# Altium project KR-Df-01-EL-00.PrjPcb (part 1 of 2)
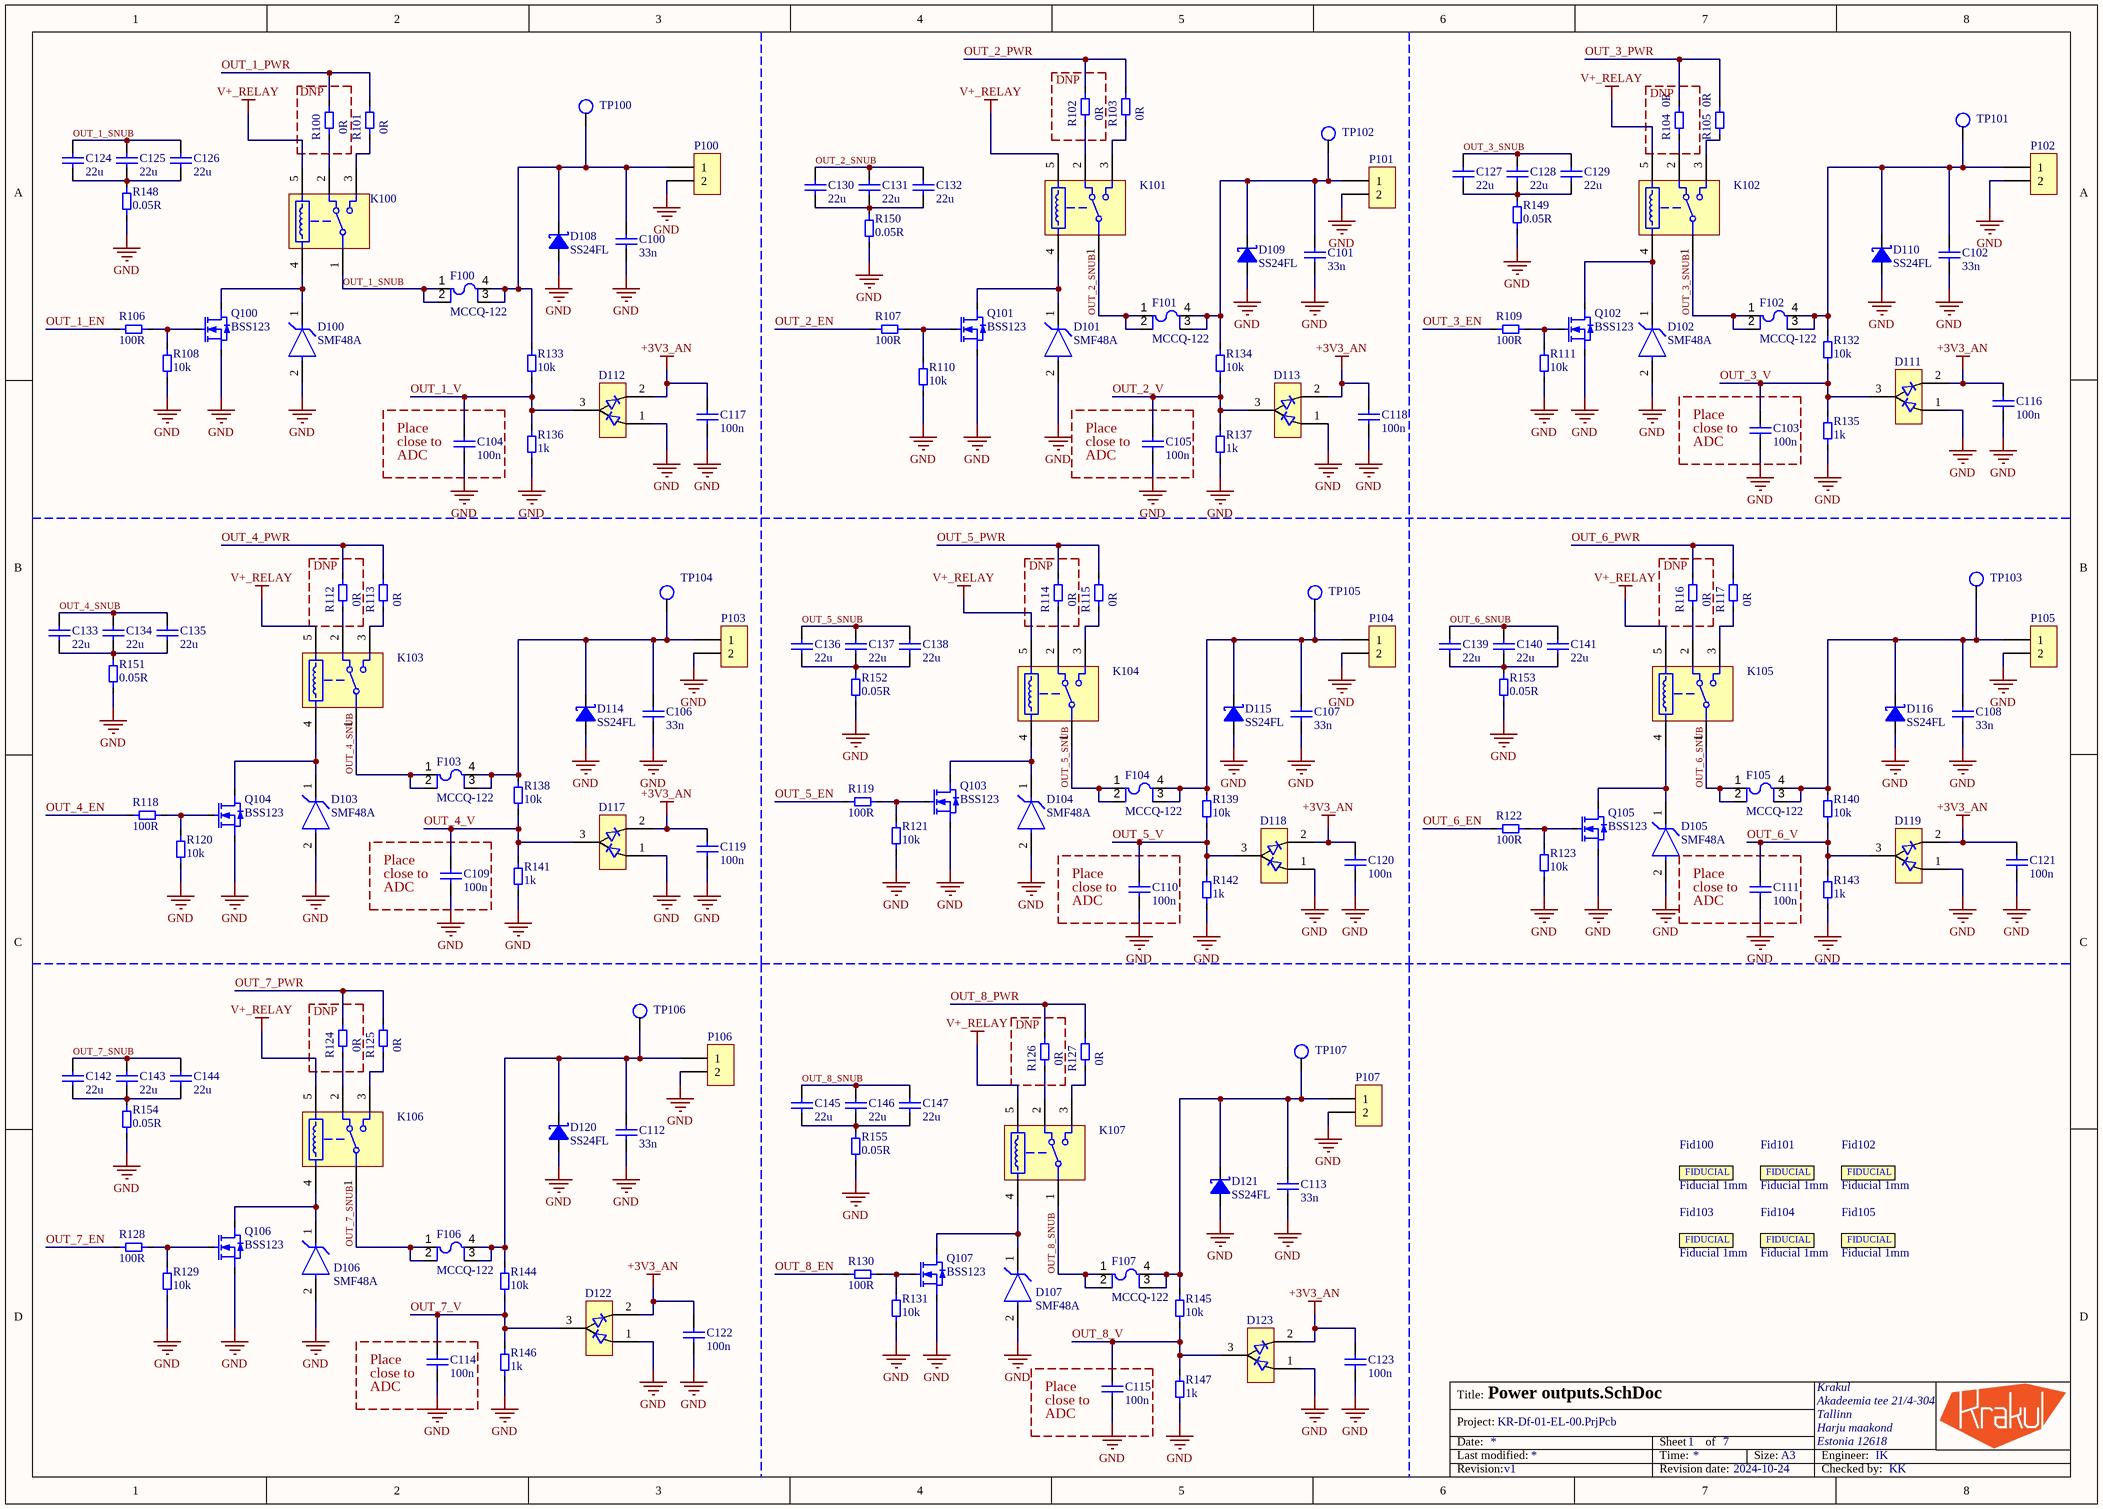
[diagram p0: Power outputs.SchDoc]
GlobalAddress1: Akadeemia tee 21/4-304; GlobalAddress2: Tallinn; GlobalAddress3: Harju maakond; GlobalAddress4: Estonia 12618; GlobalChecked: KK; GlobalCheckedBy: KK; GlobalCheckedByDate: 2024-02-23; GlobalCompanyName: Krakul; GlobalEngineer: IK; GlobalProjectRevision: v1; GlobalProjectTitle: KR-Df-01-EL-00; GlobalProjectTitleAbr: Fuse Board; GlobalRevisionDate: 2024-10-24; GlobalRevisionEngineer: IK,KK
7 sheets, 456 parts. Net scope: global (net labels, ports and power ports of the same name join across sheets).
Board file: KR-Df-01-EL-00.PcbDoc
Sheets:
  Power outputs.SchDoc
  Ethernet.SchDoc
  RS485.SchDoc
  Power input.SchDoc
  MCU.SchDoc
  LEDs_Switches.SchDoc
  Revision history.SchDoc

## Sheet Power outputs.SchDoc: Name project title here
size A3; Organization: Krakul OÜ; Address1: Kaare tee 3, lubja; Address2: viimsi vald; Address3: harju maakond; Address4: Estonia 74010; DocumentNumber: No here; Revision: 0; SheetNumber: 1; SheetTotal: 7

### Parts
C100  33n  [MLCC_0805_M]
C101  33n  [MLCC_0805_M]
C102  33n  [MLCC_0805_M]
C103  100n  [MLCC_0402_M]
C104  100n  [MLCC_0402_M]
C105  100n  [MLCC_0402_M]
C106  33n  [MLCC_0805_M]
C107  33n  [MLCC_0805_M]
C108  33n  [MLCC_0805_M]
C109  100n  [MLCC_0402_M]
C110  100n  [MLCC_0402_M]
C111  100n  [MLCC_0402_M]
C112  33n  [MLCC_0805_M]
C113  33n  [MLCC_0805_M]
C114  100n  [MLCC_0402_M]
C115  100n  [MLCC_0402_M]
C116  100n  [MLCC_0402_M]
C117  100n  [MLCC_0402_M]
C118  100n  [MLCC_0402_M]
C119  100n  [MLCC_0402_M]
C120  100n  [MLCC_0402_M]
C121  100n  [MLCC_0402_M]
C122  100n  [MLCC_0402_M]
C123  100n  [MLCC_0402_M]
C124  22u  [MLCC_0805_M]
C125  22u  [MLCC_0805_M]
C126  22u  [MLCC_0805_M]
C127  22u  [MLCC_0805_M]
C128  22u  [MLCC_0805_M]
C129  22u  [MLCC_0805_M]
C130  22u  [MLCC_0805_M]
C131  22u  [MLCC_0805_M]
C132  22u  [MLCC_0805_M]
C133  22u  [MLCC_0805_M]
C134  22u  [MLCC_0805_M]
C135  22u  [MLCC_0805_M]
C136  22u  [MLCC_0805_M]
C137  22u  [MLCC_0805_M]
C138  22u  [MLCC_0805_M]
C139  22u  [MLCC_0805_M]
C140  22u  [MLCC_0805_M]
C141  22u  [MLCC_0805_M]
C142  22u  [MLCC_0805_M]
C143  22u  [MLCC_0805_M]
C144  22u  [MLCC_0805_M]
C145  22u  [MLCC_0805_M]
C146  22u  [MLCC_0805_M]
C147  22u  [MLCC_0805_M]
D100  SMF48A  [FP-SMF48A-MFG]
D101  SMF48A  [FP-SMF48A-MFG]
D102  SMF48A  [FP-SMF48A-MFG]
D103  SMF48A  [FP-SMF48A-MFG]
D104  SMF48A  [FP-SMF48A-MFG]
D105  SMF48A  [FP-SMF48A-MFG]
D106  SMF48A  [FP-SMF48A-MFG]
D107  SMF48A  [FP-SMF48A-MFG]
D108  SS24FL  [SOD-123F]
D109  SS24FL  [SOD-123F]
D110  SS24FL  [SOD-123F]
D111  BAT6404WH6327XTSA1  [SOT323, SC70]  (value not drawn)
D112  BAT6404WH6327XTSA1  [SOT323, SC70]  (value not drawn)
D113  BAT6404WH6327XTSA1  [SOT323, SC70]  (value not drawn)
D114  SS24FL  [SOD-123F]
D115  SS24FL  [SOD-123F]
D116  SS24FL  [SOD-123F]
D117  BAT6404WH6327XTSA1  [SOT323, SC70]  (value not drawn)
D118  BAT6404WH6327XTSA1  [SOT323, SC70]  (value not drawn)
D119  BAT6404WH6327XTSA1  [SOT323, SC70]  (value not drawn)
D120  SS24FL  [SOD-123F]
D121  SS24FL  [SOD-123F]
D122  BAT6404WH6327XTSA1  [SOT323, SC70]  (value not drawn)
D123  BAT6404WH6327XTSA1  [SOT323, SC70]  (value not drawn)
F100  MCCQ-122  [MCCQ-122-Footprint-1]
F101  MCCQ-122  [MCCQ-122-Footprint-1]
F102  MCCQ-122  [MCCQ-122-Footprint-1]
F103  MCCQ-122  [MCCQ-122-Footprint-1]
F104  MCCQ-122  [MCCQ-122-Footprint-1]
F105  MCCQ-122  [MCCQ-122-Footprint-1]
F106  MCCQ-122  [MCCQ-122-Footprint-1]
F107  MCCQ-122  [MCCQ-122-Footprint-1]
Fid100  Fiducial 1mm  [FIDUCIAL 1mm]
Fid101  Fiducial 1mm  [FIDUCIAL 1mm]
Fid102  Fiducial 1mm  [FIDUCIAL 1mm]
Fid103  Fiducial 1mm  [FIDUCIAL 1mm]
Fid104  Fiducial 1mm  [FIDUCIAL 1mm]
Fid105  Fiducial 1mm  [FIDUCIAL 1mm]
K100  J107F1CS205VDC.45  [J107F1CS205VDC.45]  (value not drawn)
K101  J107F1CS205VDC.45  [J107F1CS205VDC.45]  (value not drawn)
K102  J107F1CS205VDC.45  [J107F1CS205VDC.45]  (value not drawn)
K103  J107F1CS205VDC.45  [J107F1CS205VDC.45]  (value not drawn)
K104  J107F1CS205VDC.45  [J107F1CS205VDC.45]  (value not drawn)
K105  J107F1CS205VDC.45  [J107F1CS205VDC.45]  (value not drawn)
K106  J107F1CS205VDC.45  [J107F1CS205VDC.45]  (value not drawn)
K107  J107F1CS205VDC.45  [J107F1CS205VDC.45]  (value not drawn)
P100  DGPS2.5R-5.0-02P  [DGPS2.5R-5.0-02P-Footprint-1]  (value not drawn)
P101  DGPS2.5R-5.0-02P  [DGPS2.5R-5.0-02P-Footprint-1]  (value not drawn)
P102  DGPS2.5R-5.0-02P  [DGPS2.5R-5.0-02P-Footprint-1]  (value not drawn)
P103  DGPS2.5R-5.0-02P  [DGPS2.5R-5.0-02P-Footprint-1]  (value not drawn)
P104  DGPS2.5R-5.0-02P  [DGPS2.5R-5.0-02P-Footprint-1]  (value not drawn)
P105  DGPS2.5R-5.0-02P  [DGPS2.5R-5.0-02P-Footprint-1]  (value not drawn)
P106  DGPS2.5R-5.0-02P  [DGPS2.5R-5.0-02P-Footprint-1]  (value not drawn)
P107  DGPS2.5R-5.0-02P  [DGPS2.5R-5.0-02P-Footprint-1]  (value not drawn)
Q100  BSS123  [SOT-23-3]
Q101  BSS123  [SOT-23-3]
Q102  BSS123  [SOT-23-3]
Q103  BSS123  [SOT-23-3]
Q104  BSS123  [SOT-23-3]
Q105  BSS123  [SOT-23-3]
Q106  BSS123  [SOT-23-3]
Q107  BSS123  [SOT-23-3]
R100  Value 2: 0R  [TLRZ2BTTD-Footprint-1]  (hidden comment: TLRZ2BTTD)
R101  Value 2: 0R  [TLRZ2BTTD-Footprint-1]  (hidden comment: TLRZ2BTTD)
R102  Value 2: 0R  [TLRZ2BTTD-Footprint-1]  (hidden comment: TLRZ2BTTD)
R103  Value 2: 0R  [TLRZ2BTTD-Footprint-1]  (hidden comment: TLRZ2BTTD)
R104  Value 2: 0R  [TLRZ2BTTD-Footprint-1]  (hidden comment: TLRZ2BTTD)
R105  Value 2: 0R  [TLRZ2BTTD-Footprint-1]  (hidden comment: TLRZ2BTTD)
R106  100R  [Resistor_0603_M]
R107  100R  [Resistor_0603_M]
R108  10k  [Resistor_0603_M]
R109  100R  [Resistor_0603_M]
R110  10k  [Resistor_0603_M]
R111  10k  [Resistor_0603_M]
R112  Value 2: 0R  [TLRZ2BTTD-Footprint-1]  (hidden comment: TLRZ2BTTD)
R113  Value 2: 0R  [TLRZ2BTTD-Footprint-1]  (hidden comment: TLRZ2BTTD)
R114  Value 2: 0R  [TLRZ2BTTD-Footprint-1]  (hidden comment: TLRZ2BTTD)
R115  Value 2: 0R  [TLRZ2BTTD-Footprint-1]  (hidden comment: TLRZ2BTTD)
R116  Value 2: 0R  [TLRZ2BTTD-Footprint-1]  (hidden comment: TLRZ2BTTD)
R117  Value 2: 0R  [TLRZ2BTTD-Footprint-1]  (hidden comment: TLRZ2BTTD)
R118  100R  [Resistor_0603_M]
R119  100R  [Resistor_0603_M]
R120  10k  [Resistor_0603_M]
R121  10k  [Resistor_0603_M]
R122  100R  [Resistor_0603_M]
R123  10k  [Resistor_0603_M]
R124  Value 2: 0R  [TLRZ2BTTD-Footprint-1]  (hidden comment: TLRZ2BTTD)
R125  Value 2: 0R  [TLRZ2BTTD-Footprint-1]  (hidden comment: TLRZ2BTTD)
R126  Value 2: 0R  [TLRZ2BTTD-Footprint-1]  (hidden comment: TLRZ2BTTD)
R127  Value 2: 0R  [TLRZ2BTTD-Footprint-1]  (hidden comment: TLRZ2BTTD)
R128  100R  [Resistor_0603_M]
R129  10k  [Resistor_0603_M]
R130  100R  [Resistor_0603_M]
R131  10k  [Resistor_0603_M]
R132  10k  [Resistor_0603_M]
R133  10k  [Resistor_0603_M]
R134  10k  [Resistor_0603_M]
R135  1k  [Resistor_0603_M]
R136  1k  [Resistor_0603_M]
R137  1k  [Resistor_0603_M]
R138  10k  [Resistor_0603_M]
R139  10k  [Resistor_0603_M]
R140  10k  [Resistor_0603_M]
R141  1k  [Resistor_0603_M]
R142  1k  [Resistor_0603_M]
R143  1k  [Resistor_0603_M]
R144  10k  [Resistor_0603_M]
R145  10k  [Resistor_0603_M]
R146  1k  [Resistor_0603_M]
R147  1k  [Resistor_0603_M]
R148  0.05R  [0805 resisitor based on RCWE080550L0FNEA]
R149  0.05R  [0805 resisitor based on RCWE080550L0FNEA]
R150  0.05R  [0805 resisitor based on RCWE080550L0FNEA]
R151  0.05R  [0805 resisitor based on RCWE080550L0FNEA]
R152  0.05R  [0805 resisitor based on RCWE080550L0FNEA]
R153  0.05R  [0805 resisitor based on RCWE080550L0FNEA]
R154  0.05R  [0805 resisitor based on RCWE080550L0FNEA]
R155  0.05R  [0805 resisitor based on RCWE080550L0FNEA]
TP100  Testpoint 1mm  [Testpoint 1mm]  (value not drawn)  (no BOM)
TP101  Testpoint 1mm  [Testpoint 1mm]  (value not drawn)  (no BOM)
TP102  Testpoint 1mm  [Testpoint 1mm]  (value not drawn)  (no BOM)
TP103  Testpoint 1mm  [Testpoint 1mm]  (value not drawn)  (no BOM)
TP104  Testpoint 1mm  [Testpoint 1mm]  (value not drawn)  (no BOM)
TP105  Testpoint 1mm  [Testpoint 1mm]  (value not drawn)  (no BOM)
TP106  Testpoint 1mm  [Testpoint 1mm]  (value not drawn)  (no BOM)
TP107  Testpoint 1mm  [Testpoint 1mm]  (value not drawn)  (no BOM)

### Blocks framed on the sheet
DNP: R100
DNP: R102
DNP: R104
DNP: R112
DNP: R114
DNP: R116
DNP: R124
DNP: R126

### Nets
+3V3_AN: C116.2 C117.2 C118.2 C119.2 C120.2 C121.2 C122.2 C123.2 D111.2 D112.2 D113.2 D117.2 D118.2 D119.2 D122.2 D123.2
GND: C100.1 C101.1 C102.1 C103.1 C104.1 C105.1 C106.1 C107.1 C108.1 C109.1 C110.1 C111.1 C112.1 C113.1 C114.1 C115.1 C116.1 C117.1 C118.1 C119.1 C120.1 C121.1 C122.1 C123.1 D100.2(A) D101.2(A) D102.2(A) D103.2(A) D104.2(A) D105.2(A) D106.2(A) D107.2(A) D108.2(A) D109.2(A) D110.2(A) D111.1 D112.1 D113.1 D114.2(A) D115.2(A) D116.2(A) D117.1 D118.1 D119.1 D120.2(A) D121.2(A) D122.1 D123.1 P100.2 P101.2 P102.2 P103.2 P104.2 P105.2 P106.2 P107.2 Q100.2(S) Q101.2(S) Q102.2(S) Q103.2(S) Q104.2(S) Q105.2(S) Q106.2(S) Q107.2(S) R108.1 R110.1 R111.1 R120.1 R121.1 R123.1 R129.1 R131.1 R135.1 R136.1 R137.1 R141.1 R142.1 R143.1 R146.1 R147.1 R148.1 R149.1 R150.1 R151.1 R152.1 R153.1 R154.1 R155.1
V+_RELAY: K100.5(COIL2) K101.5(COIL2) K102.5(COIL2) K103.5(COIL2) K104.5(COIL2) K105.5(COIL2) K106.5(COIL2) K107.5(COIL2)
OUT_1_EN: R106.1
OUT_1_PWR: R100.2 R101.2
OUT_1_SNUB: C124.2 C125.2 C126.2 F100.1 F100.2 K100.1(COM)
OUT_1_V: C104.2 D112.3 R133.1 R136.2
OUT_2_EN: R107.1
OUT_2_PWR: R102.2 R103.2
OUT_2_SNUB: C130.2 C131.2 C132.2 F101.1 F101.2 K101.1(COM)
OUT_2_V: C105.2 D113.3 R134.1 R137.2
OUT_3_EN: R109.1
OUT_3_PWR: R104.2 R105.2
OUT_3_SNUB: C127.2 C128.2 C129.2 F102.1 F102.2 K102.1(COM)
OUT_3_V: C103.2 D111.3 R132.1 R135.2
OUT_4_EN: R118.1
OUT_4_PWR: R112.2 R113.2
OUT_4_SNUB: C133.2 C134.2 C135.2 F103.1 F103.2 K103.1(COM)
OUT_4_V: C109.2 D117.3 R138.1 R141.2
OUT_5_EN: R119.1
OUT_5_PWR: R114.2 R115.2
OUT_5_SNUB: C136.2 C137.2 C138.2 F104.1 F104.2 K104.1(COM)
OUT_5_V: C110.2 D118.3 R139.1 R142.2
OUT_6_EN: R122.1
OUT_6_PWR: R116.2 R117.2
OUT_6_SNUB: C139.2 C140.2 C141.2 F105.1 F105.2 K105.1(COM)
OUT_6_V: C111.2 D119.3 R140.1 R143.2
OUT_7_EN: R128.1
OUT_7_PWR: R124.2 R125.2
OUT_7_SNUB: C142.2 C143.2 C144.2 F106.1 F106.2 K106.1(COM)
OUT_7_V: C114.2 D122.3 R144.1 R146.2
OUT_8_EN: R130.1
OUT_8_PWR: R126.2 R127.2
OUT_8_SNUB: C145.2 C146.2 C147.2 F107.1 F107.2 K107.1(COM)
OUT_8_V: C115.2 D123.3 R145.1 R147.2
NetC100_2: C100.2 D108.1(C) F100.3 F100.4 P100.1 R133.2 TP100.1
NetC101_2: C101.2 D109.1(C) F101.3 F101.4 P101.1 R134.2 TP102.1
NetC102_2: C102.2 D110.1(C) F102.3 F102.4 P102.1 R132.2 TP101.1
NetC106_2: C106.2 D114.1(C) F103.3 F103.4 P103.1 R138.2 TP104.1
NetC107_2: C107.2 D115.1(C) F104.3 F104.4 P104.1 R139.2 TP105.1
NetC108_2: C108.2 D116.1(C) F105.3 F105.4 P105.1 R140.2 TP103.1
NetC112_2: C112.2 D120.1(C) F106.3 F106.4 P106.1 R144.2 TP106.1
NetC113_2: C113.2 D121.1(C) F107.3 F107.4 P107.1 R145.2 TP107.1
NetC124_1: C124.1 C125.1 C126.1 R148.2
NetC127_1: C127.1 C128.1 C129.1 R149.2
NetC130_1: C130.1 C131.1 C132.1 R150.2
NetC133_1: C133.1 C134.1 C135.1 R151.2
NetC136_1: C136.1 C137.1 C138.1 R152.2
NetC139_1: C139.1 C140.1 C141.1 R153.2
NetC142_1: C142.1 C143.1 C144.1 R154.2
NetC145_1: C145.1 C146.1 C147.1 R155.2
NetD100_1: D100.1(C) K100.4(COIL1) Q100.3(D)
NetD101_1: D101.1(C) K101.4(COIL1) Q101.3(D)
NetD102_1: D102.1(C) K102.4(COIL1) Q102.3(D)
NetD103_1: D103.1(C) K103.4(COIL1) Q104.3(D)
NetD104_1: D104.1(C) K104.4(COIL1) Q103.3(D)
NetD105_1: D105.1(C) K105.4(COIL1) Q105.3(D)
NetD106_1: D106.1(C) K106.4(COIL1) Q106.3(D)
NetD107_1: D107.1(C) K107.4(COIL1) Q107.3(D)
NetK100_2: K100.2(NO) R100.1
NetK100_3: K100.3(NC) R101.1
NetK101_2: K101.2(NO) R102.1
NetK101_3: K101.3(NC) R103.1
NetK102_2: K102.2(NO) R104.1
NetK102_3: K102.3(NC) R105.1
NetK103_2: K103.2(NO) R112.1
NetK103_3: K103.3(NC) R113.1
NetK104_2: K104.2(NO) R114.1
NetK104_3: K104.3(NC) R115.1
NetK105_2: K105.2(NO) R116.1
NetK105_3: K105.3(NC) R117.1
NetK106_2: K106.2(NO) R124.1
NetK106_3: K106.3(NC) R125.1
NetK107_2: K107.2(NO) R126.1
NetK107_3: K107.3(NC) R127.1
NetQ100_1: Q100.1(G) R106.2 R108.2
NetQ101_1: Q101.1(G) R107.2 R110.2
NetQ102_1: Q102.1(G) R109.2 R111.2
NetQ103_1: Q103.1(G) R119.2 R121.2
NetQ104_1: Q104.1(G) R118.2 R120.2
NetQ105_1: Q105.1(G) R122.2 R123.2
NetQ106_1: Q106.1(G) R128.2 R129.2
NetQ107_1: Q107.1(G) R130.2 R131.2

### Notes on the sheet
- (near C104) Place
- (near C104) close to
- (near C105) Place
- (near C105) close to
- (near C103) Place
- (near C103) close to
- (near C103) ADC
- (near C104) ADC
- (near C105) ADC
- (near C109) Place
- (near C109) close to
- (near C109) ADC
- (near C110) Place
- (near C110) close to
- (near C110) ADC
- Place
- (near C111) close to
- ADC
- (near C114) Place
- (near C114) close to
- (near C114) ADC
- (near C115) Place
- (near C115) close to
- (near C115) ADC
- Title:
- Date:
- Last modified:
- Project:
- Sheet
- Time:
- of
- Size:
- A3
- Engineer:
- Revision:
- Revision date:
- Checked by:
- (in symbol CMP-001-1226-1) FIDUCIAL

### Library data of the parts
C100-C102 C106-C108 C112 C113 = CMP-001-1076-2: MLCC, 0805, 33n, 10%, 50V, X7R; Manufacturer: Any; Capacitor Type: Ceramic; Value: 33nF; Case/Package: 0805; Part number: MLCC, 0805, 33n, 10%, 50V, X7R; Dielectric: X7R; Voltage: 50V; Tolerance: 10%; RoHS: Yes; Mount: SMD
C103-C105 C109-C111 C114-C123 = CMP-001-1256-2: MLCC, 0402, 100n, 10%, 10V, X5R; Manufacturer: Any; Capacitor Type: Ceramic; Value: 100nF; Case/Package: 0402; Part number: MLCC, 0402, 100n, 10%, 10V, X5R; RoHS: Yes; Tolerance: 10%; Mount: SMD; Voltage: 10V; Dielectric: X5R
C124-C147 = CMP-001-1665-1: MLCC, 0805, 22u, 20%, 35V, X5R; Part number: C2012X5R1V226M125AC; Manufacturer: TDK; Capacitor Type: Ceramic; Value: 22µF; Dielectric: X5R; Mount: SMD; RoHS: Yes; Voltage: 35V; Tolerance: 20%; Case/Package: 0805
D100-D107 = CMP-ROOT-01053-2: Diode TVS Single Uni-Dir 48V 200W 2-Pin SOD-123F T/R; Manufacturer: Littelfuse; Breakdown Voltage: 58.9V; Clamping Voltage: 77.4V; Diode Type: ZENER; Max Surge Current: 2.6A; Min Breakdown Voltage: 53.3V; Number of Channels: 1; Polarity: Unidirectional; Power Line Protection: No; Case/Package: SMF; Mount: SMD; Part number: SMF48A; Pins: 2; RoHS: Yes; Lead Free: Contains Lead; Max Operating Temperature: 150°C; Min Operating Temperature: -55°C; Mounting Technology: Surface Mount; Number of Unidirectional Channels: 1; Packaging: Tape and Reel; Peak Pulse Current: 2.6A; Peak Pulse Power: 200W; Reverse Standoff Voltage: 48V; RoHS Compliant: Yes; Series: SMF; Termination: SMD/SMT
D108-D110 D114-D116 D120 D121 = CMP-ROOT-00473-1: Diode Schottky 40V 2A Surface Mount SOD-123F; Manufacturer: ON Semiconductor; Max Forward Surge Current (Ifsm): 50A; Reverse Recovery Time: 9.495ns; Element Configuration: Single; RoHS: Yes; Number of Pins: 2; Mount: Surface Mount; Packaging: Tape and Reel; Max Repetitive Reverse Voltage (Vrrm): 40V; Weight: 0.0276g; Average Rectified Current: 2A; Case/Package: SOD; Max Reverse Voltage (DC): 40V; Part number: SS24FL
D111-D113 D117-D119 D122 D123 = CMP-ROOT-00071-1: Diode Array 1 Pair Series Connection Schottky 40V 120mA Surface Mount SC-70, SOT-323; Manufacturer: Infineon; Peak Non-Repetitive Surge Current: 800mA; Forward Current: 250mA; Forward Voltage: 750mV; Reverse Recovery Time: 5ns; RoHS: Yes; Radiation Hardening: No; Halogen Free: Halogen Free; Case/Package: SOT-323; Number of Pins: 3; Max Reverse Voltage (DC): 40V; Max Repetitive Reverse Voltage (Vrrm): 40V; Mount: Surface Mount; Average Rectified Current: 120mA; Max Operating Temperature: 150°C; Lead Free: Lead Free; Min Operating Temperature: -55°C; Part number: BAT6404WH6327XTSA1; Packaging: Tape and Reel; Pins: 3
F100-F107 = CMP-ROOT-01049-2: Fuseholder, Pcb Mount, Mini Blade; Manufacturer: Multicomp; Current Rating: 20A; Voltage Rating (AC): 250V; Case/Package: Holder; Mount: SMD; Part number: MCCQ-122; Pins: 4; RoHS: Yes; Fuse Current: 20A; Length: 14.7mm; Mounting Technology: Holder; Reach SVHC Compliant: Unknown; RoHS Compliant: Yes; Series: MINI; Voltage Rating (DC): 250V
Fid100-Fid105 = CMP-001-1226-1: Fiducial, round, 1mm diam; Part number: -; Manufacturer: -
K100-K107 = CMP-ROOT-01122-1: RELAY GEN PURPOSE SPDT 20A 5V; Manufacturer: CIT Relay and Switch; Case/Package: THT; Mount: SMD; Part number: J107F1CS205VDC.45; RoHS: Yes
P100-P107 = CMP-ROOT-01059-1: Spring loaded terminal block; Manufacturer: Degson; Orderr Code: 10060008518; Rated Current: 20A; Rated Voltage: 400V; Cross section: 2,5m2; Pitch: 5.0mm; Pins: 2; Part number: DGPS2.5R-5.0-02P; RoHS: Yes; Mount: TH
Q100-Q107 = CMP-ROOT-00113-5: MOSFET N-CH 100V 170MA SOT-23; Manufacturer: ON Semiconductor; Max Power Dissipation: 360mW; On-State Resistance: 6R; Threshold Voltage: 1.7V; Fall Time: 9ns; Input Capacitance: 73pF; Turn-On Delay Time: 1.7ns; Gate to Source Voltage (Vgs): 20V; Turn-Off Delay Time: 17ns; Element Configuration: Single; Number of Elements: 1; Max Operating Temperature: 150°C; Rise Time: 9ns; Nominal Vgs: 1.7V; Height: 0.93mm; Radiation Hardening: No; Power Dissipation: 360mW; Drain to Source Resistance: 6R; Voltage Rating (DC): 100V; Drain to Source Voltage (Vdss): 100V; Package Quantity: 1; Length: 2.92mm; Lead Free: Lead Free; Width: 1.3mm; Drain to Source Breakdown Voltage: 100V; Contact Plating: Tin,Matte; Current Rating: 170mA; Rds On Max: 6R; Dual Supply Voltage: 100V; Voltage: 100V; Number of Pins: 3; Mount: Surface Mount; Part number: BSS123; Continuous Drain Current (ID): 170mA; REACH SVHC: No SVHC; RoHS: Yes; Min Operating Temperature: -55°C; Packaging: Tape and Reel; Case/Package: SOT-23
R100-R105 R112-R117 R124-R127 = CMP-0001-00276-2: Res Metal Plate 1206 0 Ohm Sulfur Resistant Pad SMD Automotive T/R; Manufacturer: KOA Speer Electronics; Current: 50A; Value: 0; Case/Package: 1206; Mount: SMD; Part number: TLRZ2BTTD; Pins: 2; RoHS: Yes; Case Code (Imperial): 1206; Case Code (Metric): 3216; Features: Automotive AEC-Q200; Max Operating Temperature: 170°C; Min Operating Temperature: -55°C; Number of Terminations: 2; Packaging: Cut Tape; Ratings: AEC-Q200; RoHS Compliant: Yes; Series: TLRZ
R106 R107 R109 R118 R119 R122 R128 R130 = CMP-001-0053-3: Resistor, 0603, 100R, 1%, 1/10W; Manufacturer: Any; Value: 100; Power: 100mW; RoHS: Yes; Case/Package: 0603; Tolerance: 1%; Part number: Resistor, 0603, 100R, 1%, 1/10W; Mount: SMD
R108 R110 R111 R120 R121 R123 R129 R131-R134 R138-R140 R144 R145 = CMP-001-0101-2: Resistor, 0603, 10k, 1%, 1/10W; Manufacturer: Any; Power: 100mW; Tolerance: 1%; Value: 10k; RoHS: Yes; Mount: SMD; Case/Package: 0603; Part number: Resistor, 0603, 10k, 1%, 1/10W
R135-R137 R141-R143 R146 R147 = CMP-0001-00237-1: Resistor, 0603, 1k, 0.1%, 1/16W; Manufacturer: Any; Mount: SMD; Part number: Any; RoHS: Yes; Case/Package: 0603; Value: 1k
R148-R155 = CMP-0001-00285-1: SMD Chip Resistor, 50 MOhm, ± 1%, 250 mW, 0805 [2012 Metric], Thick Film, Anti-Sulfur; Manufacturer: Any; Part number: RCWE080550L0FNEA; Value: 50m; Max Power Dissipation: 250mW; Temperature Coefficient: 200ppm/°C; Case/Package: 0805; Mount: SMD; RoHS: Yes; Tolerance: 1%; Case Code (Imperial): 0805; Case Code (Metric): 2012; Features: Moisture Resistant,Automotive AEC-Q200; Max Operating Temperature: 155°C; Min Operating Temperature: -55°C; Number of Terminations: 2; Packaging: Cut Tape; Ratings: AEC-Q200; Series: RCWE
TP100-TP107 = CMP-001-1238-1

## Sheet Ethernet.SchDoc: Name project title here
size A3; Organization: Krakul OÜ; Address1: Kaare tee 3, lubja; Address2: viimsi vald; Address3: harju maakond; Address4: Estonia 74010; DocumentNumber: No here; Revision: 0; SheetNumber: 2; SheetTotal: 7
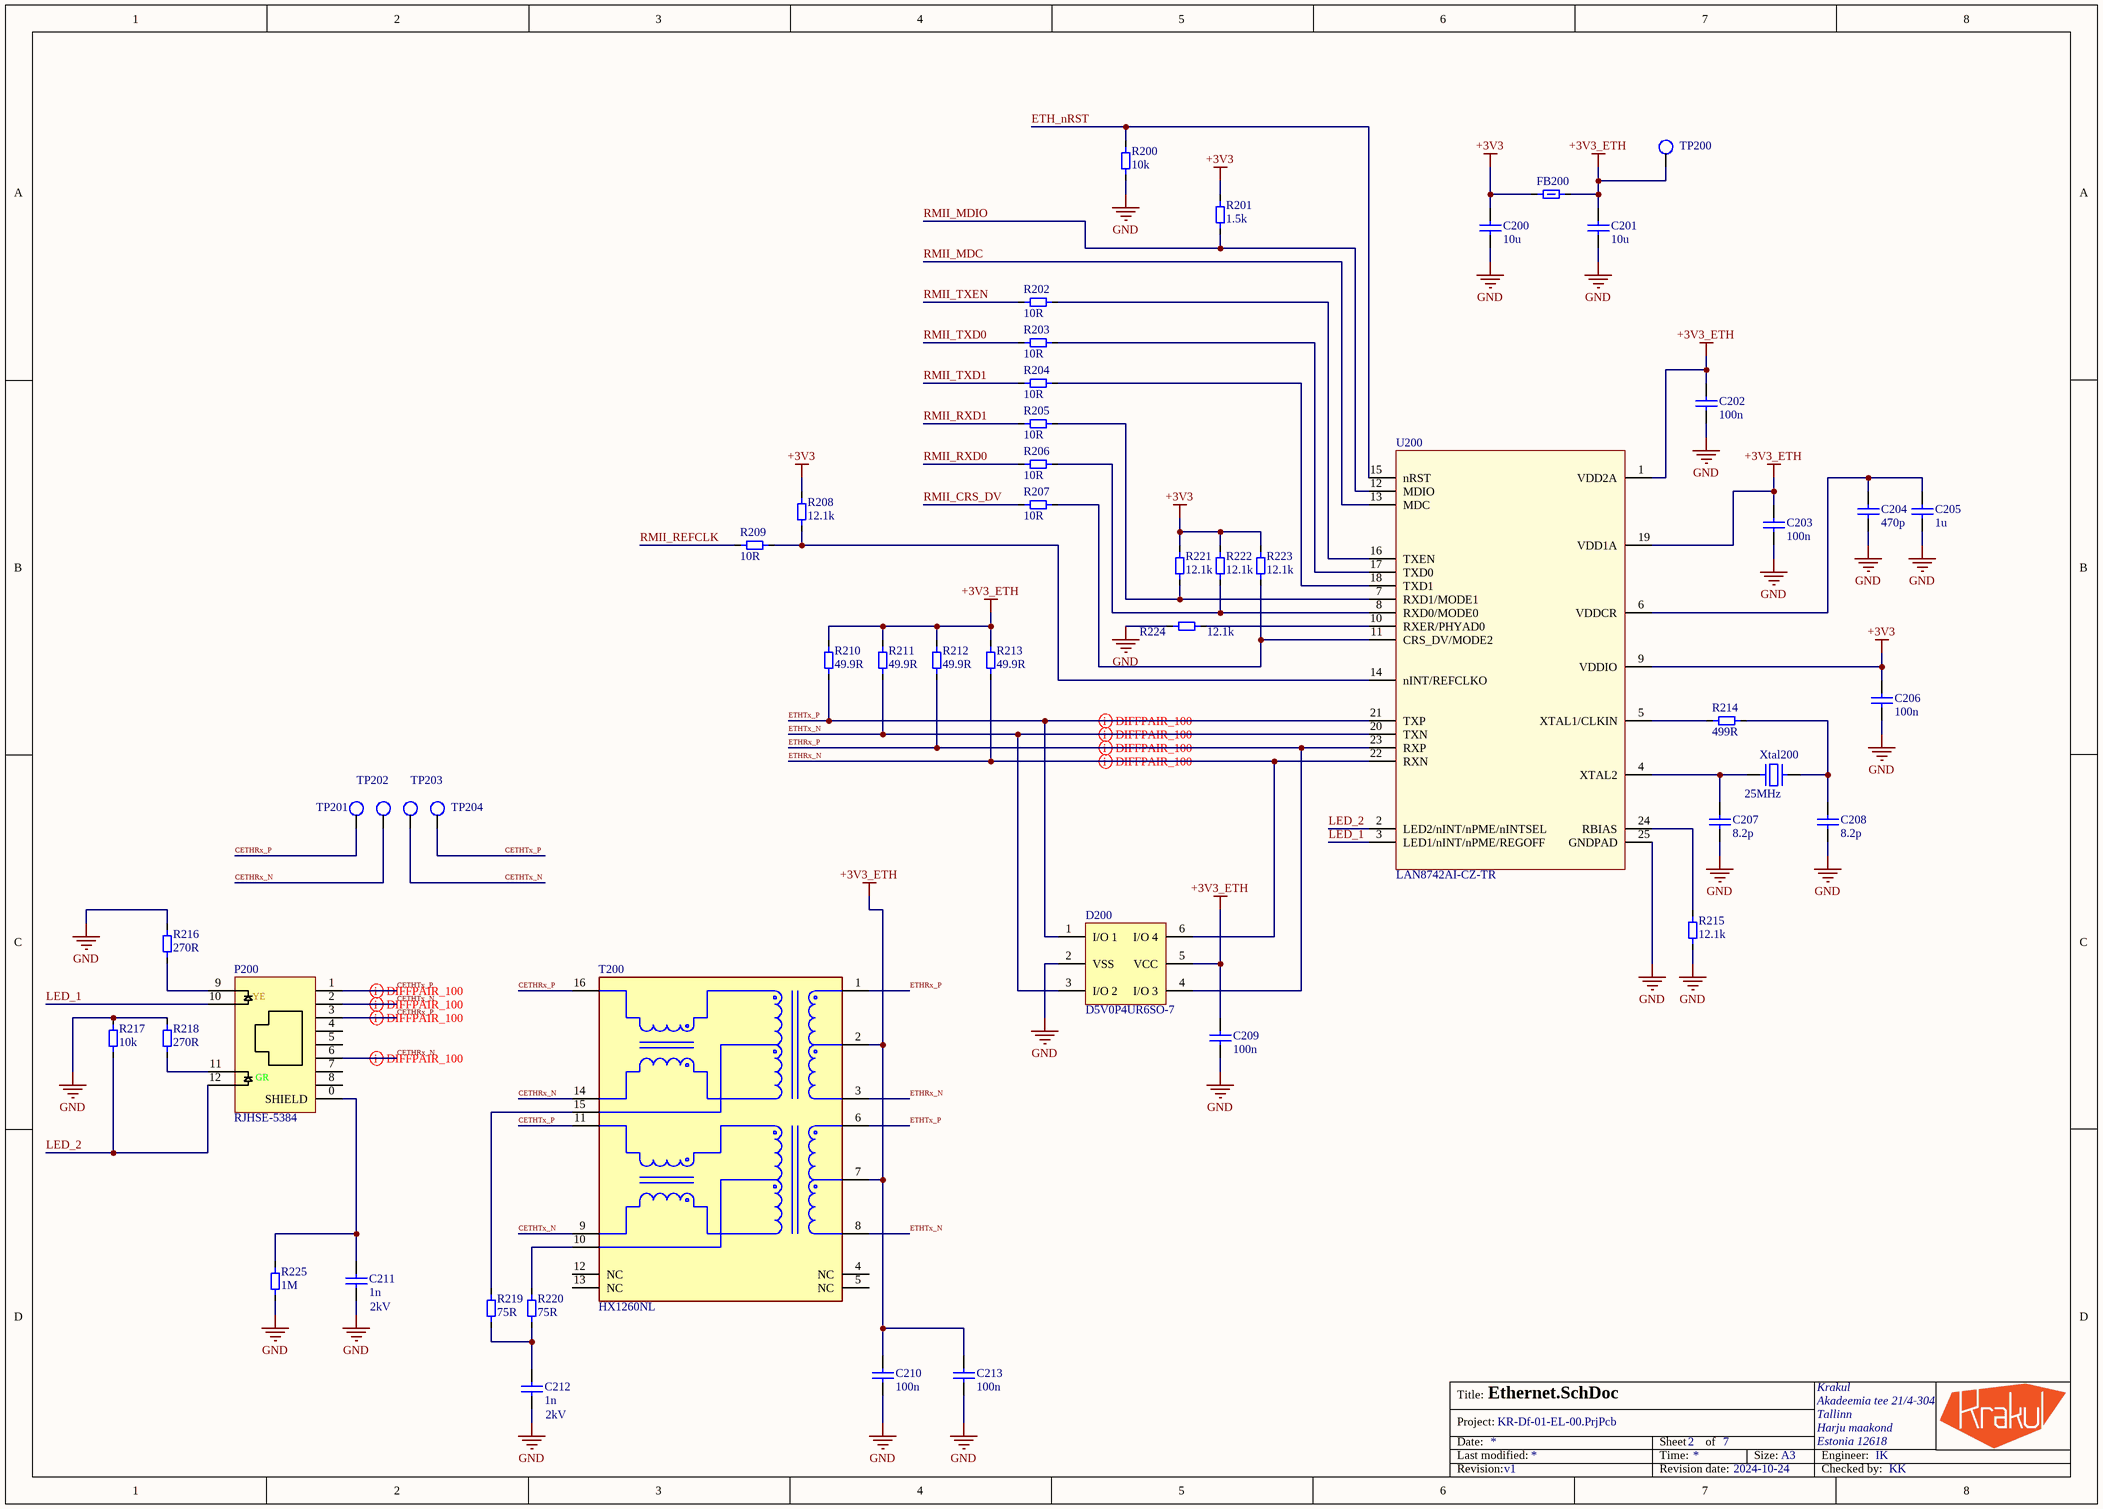
[diagram p1: Ethernet.SchDoc]

### Parts
C200  10u  [MLCC_0603_M]
C201  10u  [MLCC_0603_M]
C202  100n  [MLCC_0402_M]
C203  100n  [MLCC_0402_M]
C204  470p  [MLCC_0402_M]
C205  1u  [MLCC_0603_M]
C206  100n  [MLCC_0402_M]
C207  8.2p  [MLCC_0402_M]
C208  8.2p  [MLCC_0402_M]
C209  100n  [MLCC_0402_M]
C210  100n  [MLCC_0402_M]
C211  1n  Voltage Rating (DC): 2kV  [MLCC_1206_M]
C212  1n  Voltage Rating (DC): 2kV  [MLCC_1206_M]
C213  100n  [MLCC_0402_M]
D200  D5V0P4UR6SO-7  [SOT26]
FB200  BLM18RK601SN1D  [FP-BLM18-0_15-t0_8-IPC_B]  (value not drawn)
P200  RJHSE-5384  [RJHSE-5384]
R200  10k  [Resistor_0603_M]
R201  1.5k  [Resistor_0402_M]
R202  10R  [Resistor_0402_M]
R203  10R  [Resistor_0402_M]
R204  10R  [Resistor_0402_M]
R205  10R  [Resistor_0402_M]
R206  10R  [Resistor_0402_M]
R207  10R  [Resistor_0402_M]
R208  12.1k  [Resistor_0402_M]
R209  10R  [Resistor_0402_M]
R210  49.9R  [Resistor_0402_M]
R211  49.9R  [Resistor_0402_M]
R212  49.9R  [Resistor_0402_M]
R213  49.9R  [Resistor_0402_M]
R214  499R  [Resistor_0402_M]
R215  12.1k  [Resistor_0402_M]
R216  270R  [Resistor_0402_M]
R217  10k  [Resistor_0603_M]
R218  270R  [Resistor_0402_M]
R219  75R  [Resistor_0603_M]
R220  75R  [Resistor_0603_M]
R221  12.1k  [Resistor_0402_M]
R222  12.1k  [Resistor_0402_M]
R223  12.1k  [Resistor_0402_M]
R224  12.1k  [Resistor_0402_M]
R225  1M  [Resistor_1206_M]
T200  HX1260NL  [FP-H1102NL-MFG]
TP200  Testpoint 1mm  [Testpoint 1mm]  (value not drawn)  (no BOM)
TP201  Testpoint 1mm  [Testpoint 1mm]  (value not drawn)  (no BOM)
TP202  Testpoint 1mm  [Testpoint 1mm]  (value not drawn)  (no BOM)
TP203  Testpoint 1mm  [Testpoint 1mm]  (value not drawn)  (no BOM)
TP204  Testpoint 1mm  [Testpoint 1mm]  (value not drawn)  (no BOM)
U200  LAN8742AI-CZ-TR  [24-VFQFN Exposed Pad based on LAN8742AI-CZ-TR]
Xtal200  Frequency: 25MHz  [4-SMD Crystal 2.00mm x 1.60mm]  (hidden comment: ECS-250-10-37B-CTN-TR)

### Nets
+3V3: C200.2 C206.2 FB200.1 R201.2 R208.2 R221.2 R222.2 R223.2 U200.9(VDDIO)
+3V3_ETH: C201.2 C202.2 C203.2 C209.2 C210.2 C213.2 D200.5(VCC) FB200.2 R210.2 R211.2 R212.2 R213.2 T200.2(CT) T200.7(CT) TP200.1 U200.1(VDD2A) U200.19(VDD1A)
GND: C200.1 C201.1 C202.1 C203.1 C204.1 C205.1 C206.1 C207.1 C208.1 C209.1 C210.1 C211.2 C212.1 C213.1 D200.2(VSS) R200.1 R215.1 R216.2 R217.2 R218.2 R224.1 R225.1 U200.25(GNDPAD) Xtal200.2(GND) Xtal200.4(GND)
CETHRx_N: P200.6 T200.14(TX-) TP202.1
CETHRx_P: P200.3 T200.16(TX+) TP201.1
CETHTx_N: P200.2 T200.9(RX-) TP203.1
CETHTx_P: P200.1 T200.11(RX+) TP204.1
ETH_nRST: R200.2 U200.15(nRST)
ETHRx_N: D200.6(I/O_4) R213.1 T200.3(TD-) U200.22(RXN)
ETHRx_P: D200.4(I/O_3) R212.1 T200.1(TD+) U200.23(RXP)
ETHTx_N: D200.3(I/O_2) R211.1 T200.8(RD-) U200.20(TXN)
ETHTx_P: D200.1(I/O_1) R210.1 T200.6(RD+) U200.21(TXP)
LED_1: P200.10 U200.3(LED1/nINT/nPME/REGOFF)
LED_2: P200.12 R217.1 U200.2(LED2/nINT/nPME/nINTSEL)
RMII_CRS_DV: R207.1
RMII_MDC: U200.13(MDC)
RMII_MDIO: R201.1 U200.12(MDIO)
RMII_REFCLK: R209.1
RMII_RXD0: R206.1
RMII_RXD1: R205.1
RMII_TXD0: R203.1
RMII_TXD1: R204.1
RMII_TXEN: R202.1
NetC204_2: C204.2 C205.2 U200.6(VDDCR)
NetC207_2: C207.2 U200.4(XTAL2) Xtal200.1
NetC208_2: C208.2 R214.2 Xtal200.3
NetC211_1: C211.1 P200.0(SHIELD) R225.2
NetC212_2: C212.2 R219.1 R220.1
NetP200_9: P200.9 R216.1
NetP200_11: P200.11 R218.1
NetR202_2: R202.2 U200.16(TXEN)
NetR203_2: R203.2 U200.17(TXD0)
NetR204_2: R204.2 U200.18(TXD1)
NetR205_2: R205.2 R221.1 U200.7(RXD1/MODE1)
NetR206_2: R206.2 R222.1 U200.8(RXD0/MODE0)
NetR207_2: R207.2 R223.1 U200.11(CRS_DV/MODE2)
NetR208_1: R208.1 R209.2 U200.14(nINT/REFCLKO)
NetR214_1: R214.1 U200.5(XTAL1/CLKIN)
NetR215_2: R215.2 U200.24(RBIAS)
NetR219_2: R219.2 T200.15(NC)
NetR220_2: R220.2 T200.10(NC)
NetR224_2: R224.2 U200.10(RXER/PHYAD0)

Not connected (* = marked no-connect by the designer): P200 4 5 7 8; T200 4(NC) 5(NC) 12(NC) 13(NC)

### Layout directives
differential pair: CETHRx_N, CETHRx_P, CETHTx_N, CETHTx_P, ETHRx_N, ETHRx_P, ETHTx_N, ETHTx_P

### Notes on the sheet
- Title:
- Date:
- Last modified:
- Project:
- Sheet
- Time:
- of
- Size:
- A3
- Engineer:
- Revision:
- Revision date:
- Checked by:
- (in symbol CMP-001-1345-1) YE; GR

### Library data of the parts
C200 C201 = CMP-001-1355-1: MLCC, 0603, 10u, 10%, 25V, X5R; Manufacturer: Any; Value: 10µF; Capacitor Type: Ceramic; Voltage: 25V; Dielectric: X5R; Case/Package: 0603; Part number: MLCC, 0603, 10u, 10%, 25V, X5R; RoHS: Yes; Mount: SMD
C202 C203 C206 C209 C210 C213 = CMP-001-1256-2: as C103 on sheet Power outputs; Case/Package: 0402; Part number: MLCC, 0402, 100n, 10%, 10V, X5R; RoHS: Yes; Tolerance: 10%; Mount: SMD; Voltage: 10V; Dielectric: X5R
C204 = CMP-0001-00137-2: MLCC, 0402, 470p, 5%, 50V, C0G/NP0; Manufacturer: Any; Capacitor Type: Ceramic; Value: 470pF; Case/Package: 0402; Part number: MLCC, 0402, 470p, 5%, 50V, C0G/NP0; Dielectric: C0G/NP0; Tolerance: 5%; Mount: SMD; Voltage: 50V; RoHS: Yes
C205 = CMP-001-0642-2: MLCC, 0603, 1u, 10%, 10V, X7R; Manufacturer: Any; Capacitor Type: Ceramic; Value: 1µF; Mount: SMD; Tolerance: 10%; Case/Package: 0603; Part number: MLCC, 0603, 1u, 10%, 10V, X7R; RoHS: Yes; Voltage: 10V; Dielectric: X7R
C207 C208 = CMP-0001-00091-2: MLCC, 0402, 8.2p, 5%, 50V, C0G/NP0; Manufacturer: Any; Value: 8.2pF; Capacitor Type: Ceramic; Part number: MLCC, 0402, 8.2p, 5%, 50V, C0G/NP0; Voltage: 50V; Mount: SMD; Tolerance: 5%; Case/Package: 0402; RoHS: Yes; Dielectric: C0G/NP0
C211 C212 = CMP-001-1275-2: MLCC, 1206, 1n, 10%, 2kV, X7R; Manufacturer: Any; Insulation Resistance: 10GR; Value: 1nF; Dissipation Factor: 2.5%; Capacitor Type: Ceramic; Min Operating Temperature: -55°C; Case Code (Imperial): 1206; Voltage Rating: 2kV; Max Operating Temperature: 125°C; Lead Free: Lead Free; REACH SVHC: Unknown; Radiation Hardening: No; Depth: 1.6mm; Capacitance: 1nF; Part number: MLCC, 1206, 1n, 10%, 2kV, X7R; Width: 0.063inch; Termination: SMD/SMT; Voltage: 2kV; Case Code (Metric): 3216; Number of Pins: 2; Package Quantity: 1; Mount: Surface Mount; Tolerance: 10%; Thickness: 0.057inch; Composition: Ceramic; Height: 1.25mm; Case/Package: 1206; RoHS: Yes; Packaging: Tape and Reel; Length: 3.2mm; Dielectric: X7R
D200 = CMP-ROOT-00693-1: DIODES INC. - D5V0P4UR6SO-7 - ESD Protection Device, 1.2 V, SOT-26, 6 Pins, 3.6 V, 300 mW; Pins: 6; Part number: D5V0P4UR6SO-7; Manufacturer: Diodes Inc; Mount: Surface Mount; Case/Package: SOT-23-6; RoHS: Yes
FB200 = CMP-ROOT-01073-2: Ferrite Beads Multi-Layer 600Ohm 25% 100MHz 200mA 600mOhm DCR 0603 T/R; Manufacturer: Murata; Manufacturer Series: BLM18R; DC Resistance (DCR): 600mR; ESR (Equivalent Series Resistance): 600R; Material: Ferrite,Steel; Number of Circuits: 1; Case/Package: 0603; Mount: SMD; Part number: BLM18RK601SN1D; Pins: 2; RoHS: Yes; Contact Plating: Tin,Matte; Core Material: Ferrite; Current Rating: 200mA; DC Resistance-Max: 600mR; Height: 0.8mm; Lead Free: Lead Free; Length: 1.6mm; Max Current Rating: 200mA; Max DC Current: 200mA; Max Operating Temperature: 125°C; Min Operating Temperature: -55°C
P200 = CMP-001-1345-1: CONN MOD JACK 8P8C R/A SHIELDED, LEFT GREEN, RIGHT YELLOW; Manufacturer: Amphenol ICC; Contact Resistance: 20mR; Connector Type: Jack,RJ45; Direction: Up; Current Rating: 1.5A; Voltage Rating: 125V; Pitch: 2.03mm; Number of Positions Loaded: 8; Number of Ports: 1; Gender: Female; Depth: 15.75mm; Radiation Hardening: No; Max Operating Temperature: 85°C; Housing Material: Thermoplastic; Flammability Rating: UL94 V-0; Part number: RJHSE-5384; Lead Free: Lead Free; Voltage Rating (DC): 125V; Packaging: Tray; REACH SVHC: Unknown; Package Quantity: 120; Termination: Through Hole; Length: 16.51mm; Contact Plating: Gold; Orientation: Right Angle; Max Voltage Rating (AC): 125V; Color: Green,Yellow,Black; Min Operating Temperature: -55°C; Contact Material: Bronze; Number of Rows: 1; RoHS: Yes; Mount: Through Hole; Shielding: Shielded; Max Current Rating: 1.5A; Number of Contacts: 8; Pins: 12; Number of Positions: 8
R200 R217 = CMP-001-0101-2: as R108 on sheet Power outputs; Tolerance: 1%; Value: 10k; RoHS: Yes; Mount: SMD; Case/Package: 0603; Part number: Resistor, 0603, 10k, 1%, 1/10W
R201 = CMP-001-0344-2: Resistor, 0402, 1.5k, 1%, 1/16W; Manufacturer: Any; Power: 62mW; Mount: SMD; Tolerance: 1%; Value: 1.5k; RoHS: Yes; Case/Package: 0402; Part number: Resistor, 0402, 1.5k, 1%, 1/16W
R202-R207 R209 = CMP-001-0292-2: Resistor, 0402, 10R, 1%, 1/16W; Manufacturer: Any; Power: 62mW; Value: 10; Part number: Resistor, 0402, 10R, 1%, 1/16W; Case/Package: 0402; RoHS: Yes; Tolerance: 1%; Mount: SMD
R208 R215 R221-R224 = CMP-001-1424-1: Resistor, 0402, 12.1k, 1%, 1/16W; Manufacturer: Any; Power: 62mW; Case/Package: 0402; Value: 12.1k; Mount: SMD; RoHS: Yes; Tolerance: 1%; Part number: Resistor, 0402, 12.1k, 1%, 1/16W
R210-R213 = CMP-001-1276-1: Resistor, 0402, 49.9R, 1%, 1/16W; Manufacturer: Any; Max Power Dissipation: 63mW; Power Rating: 62.5mW; Power: 62mW; Voltage Rating: 50V; Value: 49.9; Temperature Coefficient: 100ppm/°C; Length: 1mm; Height: 0.016inch; Min Operating Temperature: -55°C; Number of Pins: 2; Width: 0.5mm; Depth: 0.5mm; Case Code (Metric): 1005; Case/Package: 0402; Part number: Resistor, 0402, 49.9R, 1%, 1/16W; Termination: SMD/SMT; REACH SVHC: No SVHC; Number of Terminations: 2; Package Quantity: 1; Composition: Thick Film; Resistance: 49.9R; RoHS: Yes; Tolerance: 1%; Working Voltage: 50V; Case Code (Imperial): 0402; Packaging: Tape and Reel; Max Operating Temperature: 155°C; Features: Moisture Resistant; Voltage Rating (DC): 50V; Military Standard: Not; Lead Free: Lead Free; Mount: SMD
R214 = CMP-001-1365-1: Resistor, 0402, 499R, 1%, 1/16W; Manufacturer: Any; Power: 62mW; Value: 499; Part number: Resistor, 0402, 499R, 1%, 1/16W; Tolerance: 1%; Mount: SMD; RoHS: Yes; Case/Package: 0402
R216 R218 = CMP-001-0326-2: Resistor, 0402, 270R, 1%, 1/16W; Manufacturer: Any; Power: 62mW; Value: 270; Tolerance: 1%; Case/Package: 0402; Part number: Resistor, 0402, 270R, 1%, 1/16W; RoHS: Yes; Mount: SMD
R219 R220 = CMP-001-0051-3: Resistor, 0603, 75R, 1%, 1/10W; Manufacturer: Any; Power: 100mW; Value: 75; RoHS: Yes; Part number: Resistor, 0603, 75R, 1%, 1/10W; Case/Package: 0603; Mount: SMD; Tolerance: 1%
R225 = CMP-0001-00051-1: Resistor, 1206, 1M, 1%, 1/4W; Manufacturer: Any; Case/Package: 1206; RoHS: Yes; Value: 1M; Mount: SMD; Part number: Any
T200 = CMP-ROOT-01078-2: Telecom Transformer 1: 1 0.65Ohm Prim. DCR 0.65Ohm Sec. DCR 16 Terminal Gull Wing SMD; Manufacturer: Pulse; Value: 350uH; Isolation Voltage: 1.5kV; Shielding: Unshielded; Turns Ratio: 1:1; Case/Package: Module; Mount: SMD; Part number: HX1260NL; Pins: 16; RoHS: Yes; Height: 6mm; Height - Seated (Max): 6.25mm; Lead/Base Style: Gull Wing; Length: 12.7mm; Max Operating Temperature: 85°C; Min Operating Temperature: -40°C; Mounting Technology: Surface Mount; Package Quantity: 40; Packaging: Rail/Tube; RoHS Compliant: Yes; Series: Star Magnetics™; Termination: SMD/SMT; Width: 7.11mm
TP200-TP204 = CMP-001-1238-1
U200 = CMP-ROOT-00367-2: Small Footprint RMII 10/100 Ethernet Transceiver with flexPWR Technology; Manufacturer: Microchip Technology; Simplex/Duplex: Full Duplex; Max Supply Voltage: 3.3V; Min Supply Voltage: 1.8V; Number of Transceivers: 1; Data Rate: 100Mbps; Case/Package: QFN; Mount: Surface Mount; Part number: LAN8742AI-CZ-TR; Min Operating Temperature: -40°C; Radiation Hardening: No; RoHS: Yes; Max Operating Temperature: 85°C; Number of Pins: 24; Packaging: Tape and Reel; Package Quantity: 5000
Xtal200 = CMP-001-1313-1: 25MHz ±10ppm Crystal 10pF 50 Ohms 4-SMD, No Lead; Manufacturer: ECS Inc.; Case/Package: 4-SMD 2.0x1.6; Part number: ECS-250-10-37B-CTN-TR; Pins: 4; Mount: SMD; RoHS: Yes

## Sheet RS485.SchDoc: Name project title here
size A3; Organization: Krakul OÜ; Address1: Kaare tee 3, lubja; Address2: viimsi vald; Address3: harju maakond; Address4: Estonia 74010; DocumentNumber: No here; Revision: 0; SheetNumber: 3; SheetTotal: 7
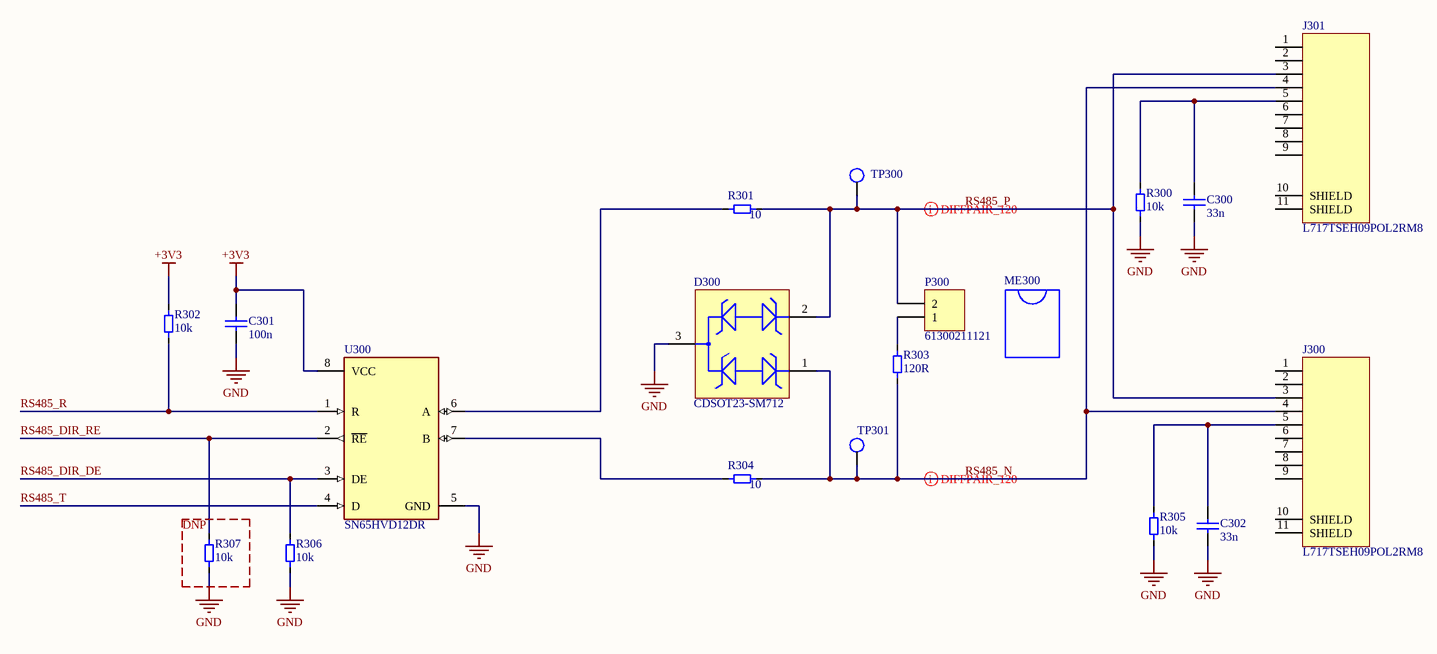
[diagram p2: RS485.SchDoc]

### Parts
C300  33n  [MLCC_0805_M]
C301  100n  [MLCC_0402_M]
C302  33n  [MLCC_0805_M]
D300  CDSOT23-SM712  [FP-SOT23-MFG]
J300  L717TSEH09POL2RM8  [L717TSEH09POL2RM8-Footprint-1]
J301  L717TSEH09POL2RM8  [L717TSEH09POL2RM8-Footprint-1]
ME300  SNT-100-BK-T-H  [SNT-100-BK-T-H-Footprint-1]  (value not drawn)
P300  61300211121  [61300211121]
R300  10k  [Resistor_0603_M]
R301  value 10  [Resistor_0603_M]  (hidden comment: CRCW0603010RJNEAHP)
R302  10k  [Resistor_0603_M]
R303  120R  [Resistor_0805_M]
R304  value 10  [Resistor_0603_M]  (hidden comment: CRCW0603010RJNEAHP)
R305  10k  [Resistor_0603_M]
R306  10k  [Resistor_0603_M]
R307  10k  [Resistor_0603_M]
TP300  Testpoint 1mm  [Testpoint 1mm]  (value not drawn)  (no BOM)
TP301  Testpoint 1mm  [Testpoint 1mm]  (value not drawn)  (no BOM)
U300  SN65HVD12DR  [FP-D0008A-IPC_B]

### Blocks framed on the sheet
DNP: R307

### Nets
+3V3: C301.2 R302.2 U300.8(VCC)
GND: C300.1 C301.1 C302.1 D300.3 R300.1 R305.1 R306.1 R307.1 U300.5(GND)
RS485_DIR_DE: R306.2 U300.3(DE)
RS485_DIR_RE: R307.2 U300.2(~{RE})
RS485_N: D300.1 J300.4 J301.4 R303.1 R304.2 TP301.1
RS485_P: D300.2 J300.3 J301.3 P300.2 R301.2 TP300.1
RS485_R: R302.1 U300.1(R)
RS485_T: U300.4(D)
NetC300_2: C300.2 J301.5 R300.2
NetC302_2: C302.2 J300.5 R305.2
NetP300_1: P300.1 R303.2
NetR301_1: R301.1 U300.6(A)
NetR304_1: R304.1 U300.7(B)

Not connected (* = marked no-connect by the designer): J300 1 2 6 7 8 9 10(SHIELD) 11(SHIELD); J301 1 2 6 7 8 9 10(SHIELD) 11(SHIELD)

### Layout directives
differential pair: RS485_N, RS485_P

### Notes on the sheet
- Title:
- Date:
- Last modified:
- Project:
- Sheet
- Time:
- of
- Size:
- A3
- Engineer:
- Revision:
- Revision date:
- Checked by:

### Library data of the parts
C300 C302 = CMP-001-1076-2: as C100 on sheet Power outputs; Case/Package: 0805; Part number: MLCC, 0805, 33n, 10%, 50V, X7R; Dielectric: X7R; Voltage: 50V; Tolerance: 10%; RoHS: Yes; Mount: SMD
C301 = CMP-001-1256-2: as C103 on sheet Power outputs; Case/Package: 0402; Part number: MLCC, 0402, 100n, 10%, 10V, X5R; RoHS: Yes; Tolerance: 10%; Mount: SMD; Voltage: 10V; Dielectric: X5R
D300 = CMP-ROOT-00649-3: BOURNS - CDSOT23-SM712 - Transient Voltage Suppressor, TVS, CDSOT23 Series, Unidirectional, 12 V, SOT-23, 3, 13.3 V; Manufacturer: Bourns Inc.; Power Line Protection: No; Peak Pulse Current: 17A; Number of Channels: 2; Peak Pulse Power: 400W; Reverse Standoff Voltage: 12V; Reverse Breakdown Voltage: 13.3V; Test Current: 1mA; Capacitance: 75pF; Direction: Bidirectional; Leakage Current: 20uA; Max Power Dissipation: 600W; ESD Protection: Yes; Clamping Voltage: 26V; Element Configuration: Dual; Max Surge Current: 30A; Polarity: Bidirectional,Unidirectional; Width: 0.055inch; Packaging: Tape and Reel; Termination: SMD/SMT; Height: 1.11mm; Radiation Hardening: No; Max Operating Temperature: 150°C; Length: 3.04mm; Case/Package: SOT-23; Number of Pins: 3; Min Breakdown Voltage: 13.3V; RoHS: Yes; Part number: CDSOT23-SM712; Depth: 1.4mm; Number of Bidirectional Channels: 2; REACH SVHC: No SVHC; Min Operating Temperature: -55°C; Package Quantity: 1; Resistor Type: Zener; Contact Plating: Tin; Mount: Surface Mount; Breakdown Voltage: 13.3V; Number of Elements: 2; Max Breakdown Voltage: 13.3V; Working Voltage: 12V; Max Reverse Leakage Current: 20uA; Power Dissipation: 400W
J300 J301 = CMP-ROOT-01058-3: Conn D-Subminiature PIN 9 POS 1.37mm Solder ST Thru-Hole 9 Terminal 1 Port; Manufacturer: Amphenol ICC; Gender: Male, Pins; Mount: TH; Part number: L717TSEH09POL2RM8; Pins: 9; RoHS: Yes; Orientation: Straight, Vertical
ME300 = CMP-ROOT-01069-1: SNT - Samtec 2.54mm Jumper Link / Shunt; Contact Resistance: 5mR; Max Current Rating: 2.5A; Number of Contacts: 2; Case/Package: 2,54 mm jumper; Manufacturer: Samtec; Mount: THT; Part number: SNT-100-BK-T-H; Pins: 0; RoHS: Yes; Color: Black; Contact Material: Bronze; Contact Plating: Tin; Depth: 2.54mm; Flammability Rating: UL94 V-0; Height: 0.24inch; Housing Color: Black; Housing Material: Polyester; Length: 50.8mm; Max Operating Temperature: 90°C; Min Operating Temperature: -40°C; Number of Rows: 1; Orientation: Straight; Package Quantity: 1; Packaging: Bulk; Pitch: 2.54mm; Radiation Hardening: No; Reach SVHC Compliant: No; RoHS Compliant: Yes; Series: SNT
P300 = CMP-001-1357-2: Headers & Wire Housings WR-PHD 2.54mm 2Pin THT Header; Manufacturer: Wurth; Number of Contacts: 2; Current Rating: 3A; Voltage Rating: 250V; Gender: Male; Connector Type: Male Pin; Pitch: 0.1inch; Color: Black; Pins: 2; Max Operating Temperature: 125°C; RoHS: Yes; Lead Free: Lead Free; Packaging: Bulk; Part number: 61300211121; Mount: Through Hole; Number of Positions: 2; Contact Material: Copper Alloy,Copper; Contact Mating Length: 0.236inch; Contact Plating: Gold; Housing Material: PBT; REACH SVHC: Unknown; Min Operating Temperature: -40°C; Contact Gender: Male; Number of Rows: 1; Termination: Through Hole
R300 R302 R305-R307 = CMP-001-0101-2: as R108 on sheet Power outputs; Tolerance: 1%; Value: 10k; RoHS: Yes; Mount: SMD; Case/Package: 0603; Part number: Resistor, 0603, 10k, 1%, 1/10W
R301 R304 = CMP-0001-00279-2: 10R 0603 Pulse-proof 1/3W; Manufacturer: Vishay; Part number: CRCW060310R0JNEAHP; Power: 330mW; Tolerance: 5%; Voltage: 75V; Max Power Dissipation: 250mW; Case/Package: 0603; Mount: SMD; Pins: 2; RoHS: Yes; Lead Free: Lead Free; Max Operating Temperature: 155°C
R303 = CMP-001-1673-1: Resistor, 0805, 120R, 1%, 1/10W; Manufacturer: Any; Power: 100mW; Value: 120; Part number: Resistor, 0805, 120R, 1%, 1/10W; Tolerance: 1%; Mount: SMD; RoHS: Yes; Case/Package: 0805
TP300 TP301 = CMP-001-1238-1
U300 = CMP-ROOT-01068-1: 1/1 Transceiver Half RS422, RS485 8-SOIC; Manufacturer: TI; Data Rate: 1Mbps; Interface: RS-485; Max Supply Voltage: 3.6V; Min Supply Voltage: 3V; Number of Drivers: 1; Operating Supply Current: 15.5mA; Operating Supply Voltage: 3.3V; Simplex/Duplex: Half Duplex; Case/Package: SOIC-8; Mount: SMD; Part number: SN65HVD12DR; Pins: 8; RoHS: Yes; Lead Free: Lead Free; Logic Function: Transceiver; Max Operating Temperature: 85°C; Min Operating Temperature: -40°C; Mounting Technology: Surface Mount; Number of Receivers: 1; Number of Transceivers: 1; Number of Transmitters: 1; Package Quantity: 1; Packaging: Tape and Reel; Radiation Hardening: No; Reach SVHC Compliant: No; RoHS Compliant: Yes; Series: -; Supply Current: 15.5mA; Weight: 0.002561oz